# Altium project amoled-watch.PrjPcb
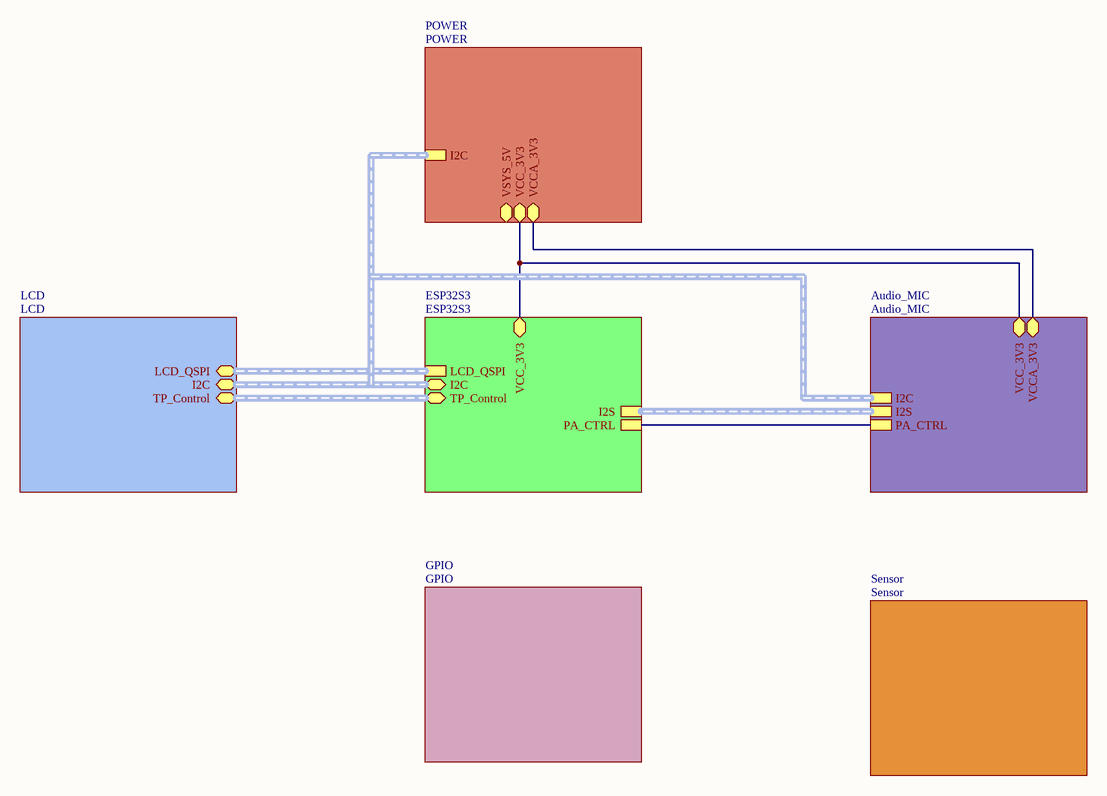
[diagram p0: Overview.SchDoc]
7 sheets, 107 parts. Net scope: hierarchical (ports join the sheet entries above them; power ports are global).
Board file: PCB1.PcbDoc
Sheets:
  Overview.SchDoc
    ESP32S3 = ESP32S3.SchDoc
    LCD = LCD.SchDoc
    Audio_MIC = Audio_MIC.SchDoc
    GPIO = GPIO.SchDoc
    Sensor = Sensor.SchDoc
  PMIC.SchDoc

## Sheet Overview.SchDoc
size A4; SheetNumber: 1; SheetTotal: 7

### Sub-sheets
Audio_MIC = Audio_MIC: VCCA_3V3 (bidir), VCC_3V3 (bidir), I2C, I2S, PA_CTRL
ESP32S3 = ESP32S3: LCD_QSPI, I2C (bidir), TP_Control (bidir), VCC_3V3 (bidir), I2S, PA_CTRL
GPIO = GPIO: no entries
LCD = LCD: LCD_QSPI (bidir), I2C (bidir), TP_Control (bidir)
POWER = POWER (file not in this document): I2C, VSYS_5V (bidir), VCC_3V3 (bidir), VCCA_3V3 (bidir)
Sensor = Sensor: no entries

### Nets
VCC_3V3: sheet ESP32S3/VCC_3V3, sheet POWER/VCC_3V3, sheet Audio_MIC/VCC_3V3
PA_CTRL: sheet ESP32S3/PA_CTRL, sheet Audio_MIC/PA_CTRL
VCCA_3V3: sheet POWER/VCCA_3V3, sheet Audio_MIC/VCCA_3V3

### Buses and harness runs
harness sheet Audio_MIC/I2C = sheet ESP32S3/I2C = sheet LCD/I2C = sheet POWER/I2C
harness sheet Audio_MIC/I2S = sheet ESP32S3/I2S
harness sheet ESP32S3/LCD_QSPI = sheet LCD/LCD_QSPI
harness sheet ESP32S3/TP_Control = sheet LCD/TP_Control

## Sheet ESP32S3.SchDoc
size A3; SheetNumber: 2; SheetTotal: 7
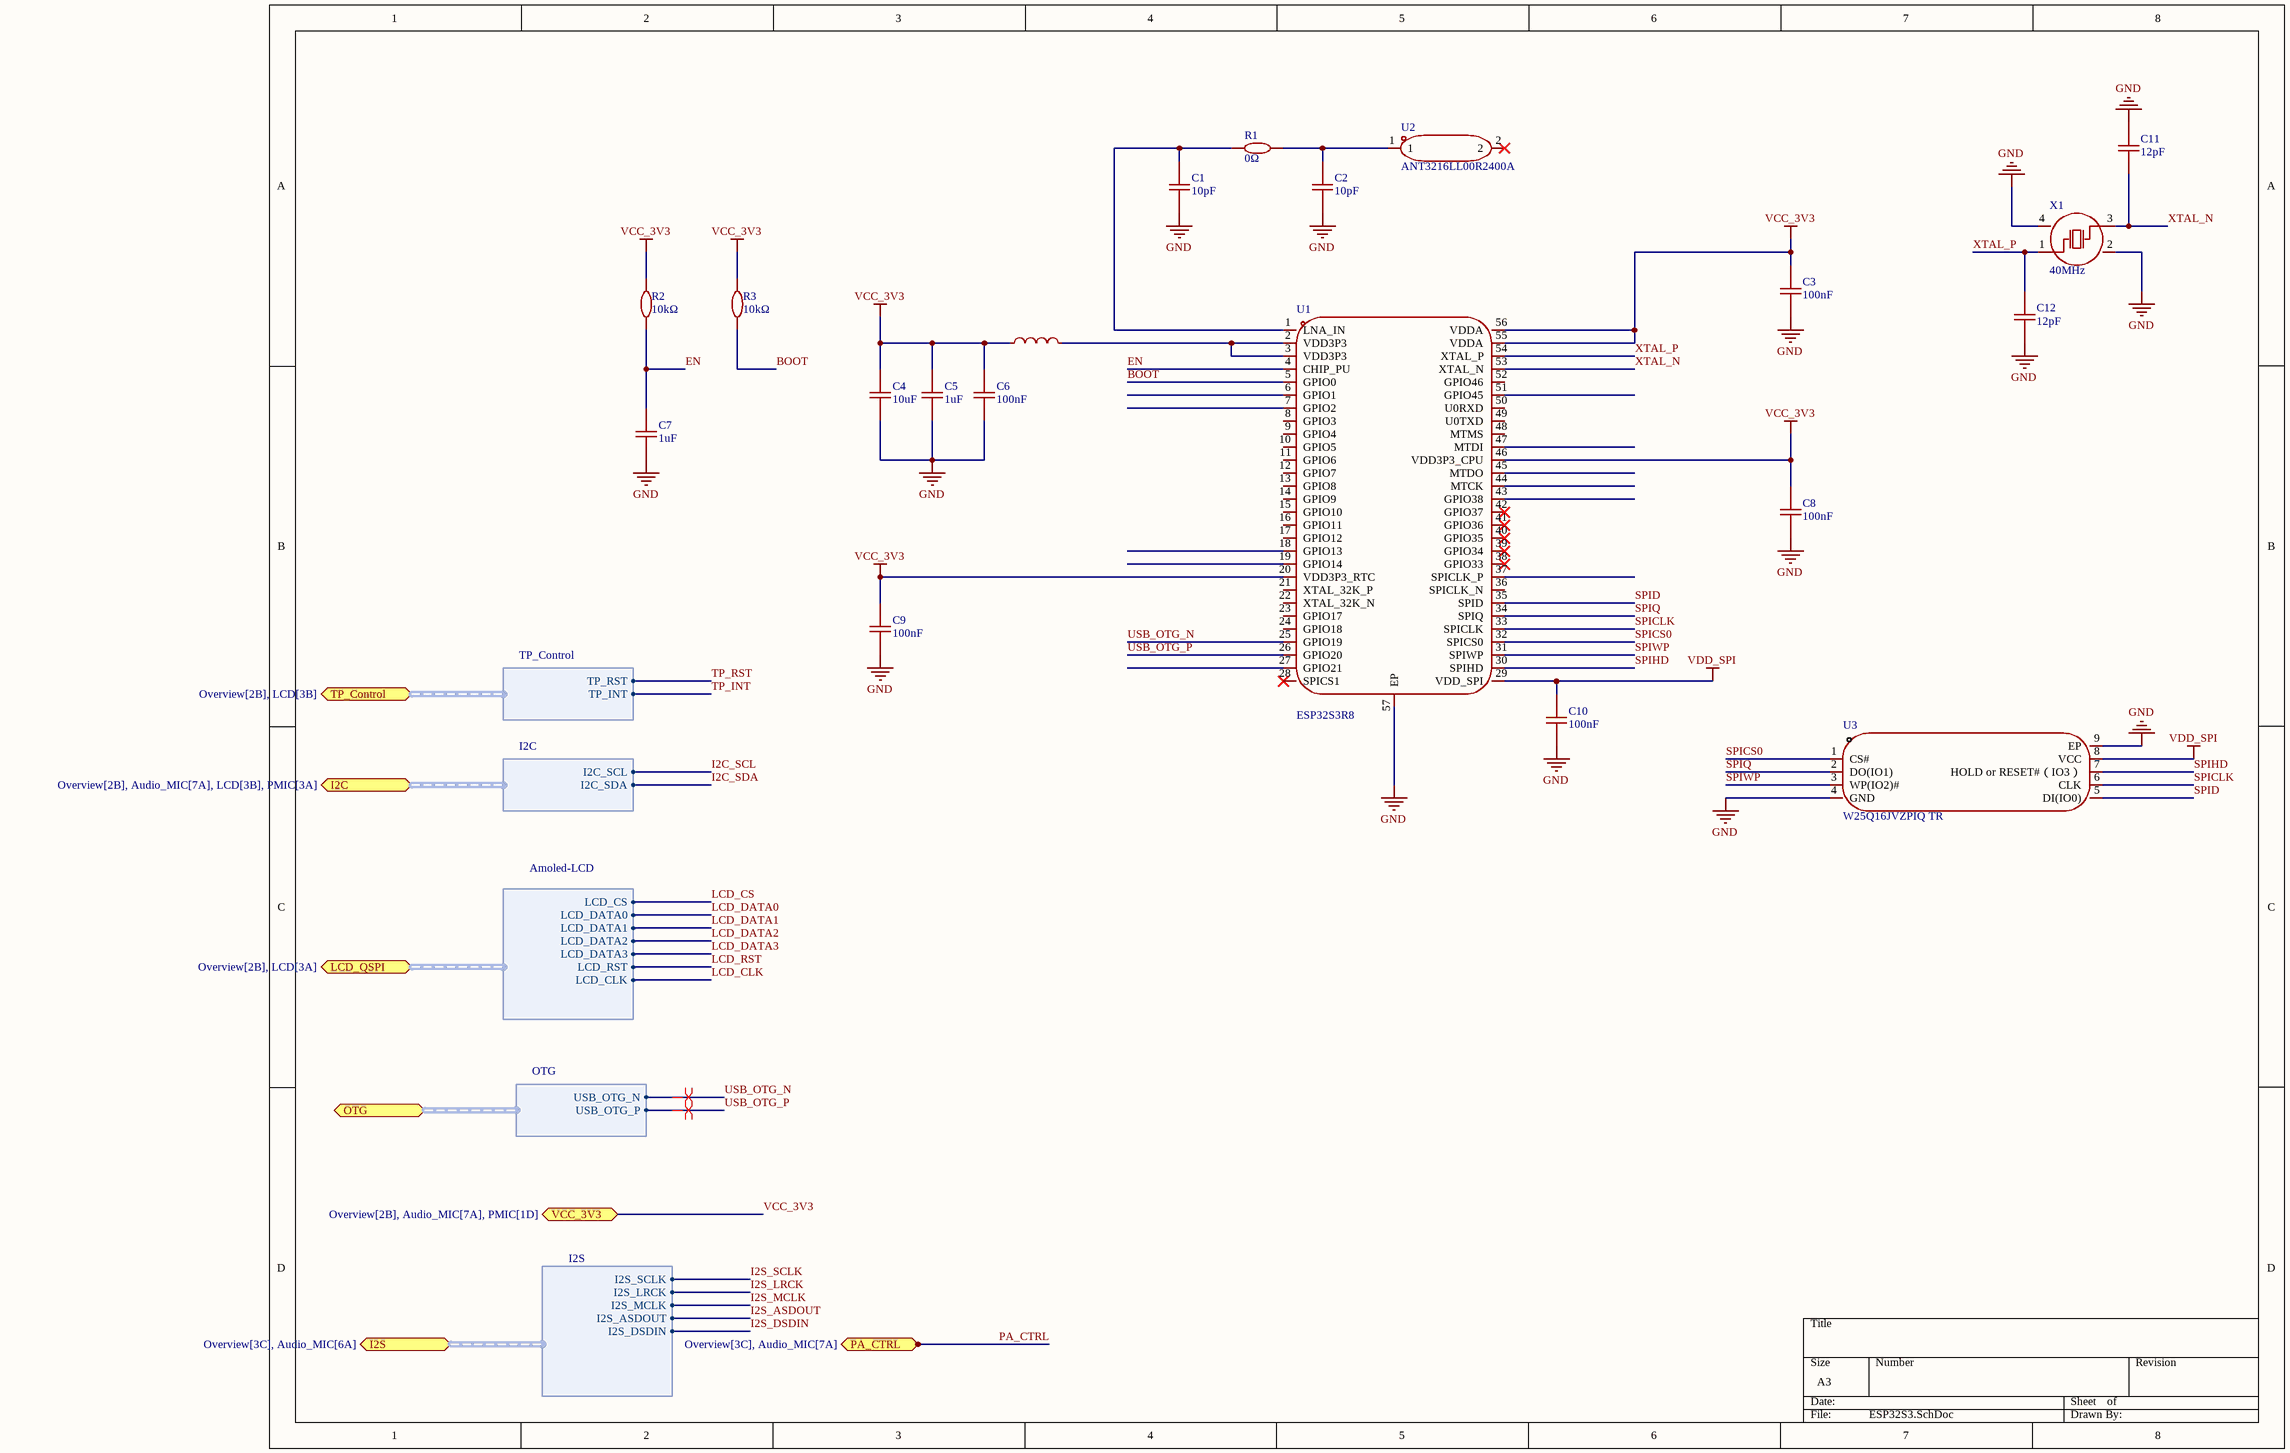
[diagram p1: ESP32S3.SchDoc]

### Parts
C1  10pF  [C0402]
C2  10pF  [C0402]
C3  100nF  [C0402]
C4  10uF  [C0603]
C5  1uF  [C0402]
C6  100nF  [C0402]
C7  1uF  [C0402]
C8  100nF  [C0402]
C9  100nF  [C0402]
C10  100nF  [C0402]
C11  12pF  [C0402]
C12  12pF  [C0402]
L1  2nH  [L0402]  (value not drawn)
R1  0Ω  [R0402]
R2  10kΩ  [R0402]
R3  10kΩ  [R0402]
U1  ESP32S3R8  [QFN-56_L7.0-W7.0-P0.40-TL-EP4.0]
U2  ANT3216LL00R2400A  [ANT-SMD_L3.2-W1.6]
U3  W25Q16JVZPIQ TR  [WSON-8_L6.0-W5.0-P1.27-BL-EP]
X1  40MHz  [OSC-SMD_4P-L3.2-W2.5-BL_SIT8008BI]

### Ports
I2C (bidir, harness I2C, see Overview[2B], Audio_MIC[7A], LCD[3B], PMIC[3A]), I2S (bidir, harness I2S, see Overview[3C], Audio_MIC[6A]), LCD_QSPI (bidir, harness Amoled-LCD, see Overview[2B], LCD[3A]), OTG (bidir, harness OTG), PA_CTRL (bidir, see Overview[3C], Audio_MIC[7A]), TP_Control (bidir, harness TP_Control, see Overview[2B], LCD[3B]), VCC_3V3 (bidir, see Overview[2B], Audio_MIC[7A], PMIC[1D])

### Harnesses
Amoled-LCD: LCD_CS, LCD_DATA0, LCD_DATA1, LCD_DATA2, LCD_DATA3, LCD_RST, LCD_CLK
I2C: I2C_SCL, I2C_SDA
TP_Control: TP_RST, TP_INT
OTG: USB_OTG_N, USB_OTG_P
I2S: I2S_SCLK, I2S_LRCK, I2S_MCLK, I2S_ASDOUT, I2S_DSDIN

### Nets
GND: C1.1 C2.1 C3.1 C4.1 C5.1 C6.1 C7.1 C8.1 C9.1 C10.1 C11.2 C12.1 U1.57(EP) U3.4(GND) U3.9(EP) X1.2(GND) X1.4(GND)
VCC_3V3: C3.2 C4.2 C5.2 C6.2 C8.2 C9.2 L1.1 R2.2 R3.2 U1.20(VDD3P3_RTC) U1.46(VDD3P3_CPU) U1.55(VDDA) U1.56(VDDA) ; port VCC_3V3
VDD_SPI: C10.2 U1.29(VDD_SPI) U3.8(VCC)
BOOT: R3.1 U1.5(GPIO0)
EN: C7.2 R2.1 U1.4(CHIP_PU)
SPICLK: U1.33(SPICLK) U3.6(CLK)
SPICS0: U1.32(SPICS0) U3.1(CS#)
SPID: U1.35(SPID) U3.5(DI(IO0))
SPIHD: U1.30(SPIHD) U3.7(HOLD_or_RESET#（IO3）)
SPIQ: U1.34(SPIQ) U3.2(DO(IO1))
SPIWP: U1.31(SPIWP) U3.3(WP(IO2)#)
USB_OTG_N: U1.25(GPIO19) ; port OTG.USB_OTG_N
USB_OTG_P: U1.26(GPIO20) ; port OTG.USB_OTG_P
XTAL_N: C11.1 U1.53(XTAL_N) X1.3(OSC2)
XTAL_P: C12.2 U1.54(XTAL_P) X1.1(OSC1)
NetC1_2: C1.2 R1.1 U1.1(LNA_IN)
NetC2_2: C2.2 R1.2 U2.1
NetL1_2: L1.2 U1.2(VDD3P3) U1.3(VDD3P3)

Not connected (* = marked no-connect by the designer): U1 6(GPIO1) 7(GPIO2) 8(GPIO3) 9(GPIO4) 10(GPIO5) 11(GPIO6) 12(GPIO7) 13(GPIO8) 14(GPIO9) 15(GPIO10) 16(GPIO11) 17(GPIO12) 18(GPIO13) 19(GPIO14) 21(XTAL_32K_P) 22(XTAL_32K_N) 23(GPIO17) 24(GPIO18) 27(GPIO21) 28(SPICS1)* 36(SPICLK_N) 37(SPICLK_P) 38(GPIO33)* 39(GPIO34)* 40(GPIO35)* 41(GPIO36)* 42(GPIO37)* 43(GPIO38) 44(MTCK) 45(MTDO) 47(MTDI) 48(MTMS) 49(U0TXD) 50(U0RXD) 51(GPIO45) 52(GPIO46); U2 2*

### Layout directives
differential pair: USB_OTG_N, USB_OTG_P

### Library data of the parts
C1 C2 = 10pF: 50V 10pF C0G ±5% 0402 Ceramic Capacitors ROHS
C3 C6 C8-C10 = 100nF: 50V 100nF X7R ±10% 0402 Ceramic Capacitors ROHS
C4 = 10uF: 10V 10uF X5R ±10% 0603 Ceramic Capacitors ROHS
C5 C7 = 1uF: 50V 1uF X5R ±10% 0402 Ceramic Capacitors ROHS
C11 C12 = 12pF: 50V 12pF C0G ±5% 0402 Ceramic Capacitors ROHS
L1 = MLG1005S2N0BT000: L0402 2nH ±0.1nH; Manufacturer: Sunltech(顺磁); Symbol: SLW4030S1R0NST; Add into BOM: yes; Value: 1uH; Tolerance: ±30%; Current Rating: 4.15A; DC Resistance(DCR): 18mΩ; Device: SLW4030S1R0NST; LCSC Part Name: 1uH ±30%; Supplier Part: C206354; Manufacturer Part: SLW4030S1R0NST; Supplier Footprint: SMD,4x4mm; JLCPCB Part Class: Extended Part; Datasheet: https://item.szlcsc.com/datasheet/SLW4030S1R0NST/207399.html; Supplier: LCSC; Convert to PCB: yes
R1 = 0Ω: 0Ω 62.5mW 50V Thick Film Resistor ±1% 0402 Chip Resistor - Surface Mount ROHS
R2 R3 = 10kΩ: 62.5mW 10kΩ 50V ±100ppm/℃ Thick Film Resistor ±1% 0402 Chip Resistor - Surface Mount ROHS
U1 = ESP32S3R8: 2.4GHz Wi-Fi + 低功耗蓝牙系统级芯片（SoC）
U3 = W25Q16JVZPIQ TR: WSON-8-EP(5x6) W25Q128JV（128M位）串行闪存为空间、引脚和电源受限的系统提供了存储解决方案。25Q系列具备灵活性和高性能。
X1 = X322540MPB4SI: Crystal Oscillator 15pF SMD3225-4P Crystals ROHS

## Sheet LCD.SchDoc
size A4; SheetNumber: 4; SheetTotal: 7
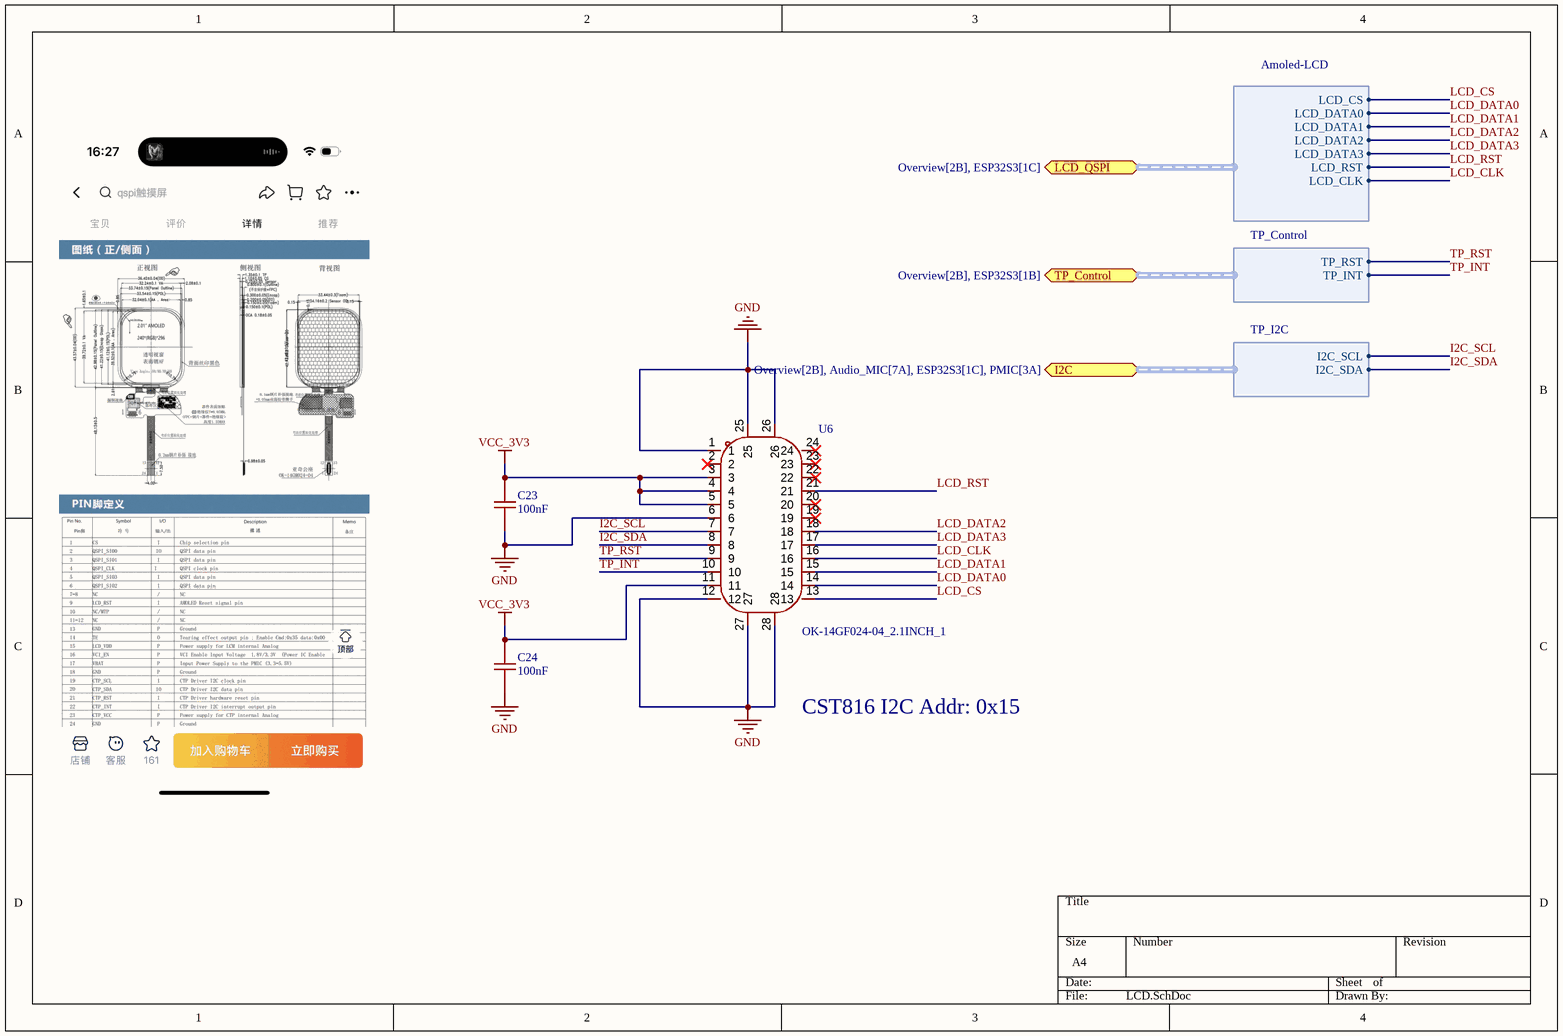
[diagram p2: LCD.SchDoc]

### Parts
C23  100nF  [C0402]
C24  100nF  [C0402]
U6  OK-14GF024-04_2.1INCH_1  [CONN-SMD_24P-P0.40_OK-14GF024-04_2.1INCH]

### Ports
I2C (bidir, harness TP_I2C, see Overview[2B], Audio_MIC[7A], ESP32S3[1C], PMIC[3A]), LCD_QSPI (bidir, harness Amoled-LCD, see Overview[2B], ESP32S3[1C]), TP_Control (bidir, harness TP_Control, see Overview[2B], ESP32S3[1B])

### Harnesses
Amoled-LCD: LCD_CS, LCD_DATA0, LCD_DATA1, LCD_DATA2, LCD_DATA3, LCD_RST, LCD_CLK
TP_I2C: I2C_SCL, I2C_SDA
TP_Control: TP_RST, TP_INT

### Nets
GND: C23.1 C24.1 U6.1 U6.6 U6.12 U6.25 U6.26 U6.27 U6.28
VCC_3V3: C23.2 C24.2 U6.3 U6.4 U6.5 U6.11
I2C_SCL: U6.7 ; port I2C.I2C_SCL
I2C_SDA: U6.8 ; port I2C.I2C_SDA
LCD_CLK: U6.16 ; port LCD_QSPI.LCD_CLK
LCD_CS: U6.13 ; port LCD_QSPI.LCD_CS
LCD_DATA0: U6.14 ; port LCD_QSPI.LCD_DATA0
LCD_DATA1: U6.15 ; port LCD_QSPI.LCD_DATA1
LCD_DATA2: U6.18 ; port LCD_QSPI.LCD_DATA2
LCD_DATA3: U6.17 ; port LCD_QSPI.LCD_DATA3
LCD_RST: U6.21 ; port LCD_QSPI.LCD_RST
TP_INT: U6.10 ; port TP_Control.TP_INT
TP_RST: U6.9 ; port TP_Control.TP_RST

Not connected (* = marked no-connect by the designer): U6 2* 19* 20* 22* 23* 24*

### Notes on the sheet
- CST816 I2C Addr: 0x15

### Library data of the parts
C23 C24 = 100nF: as C3 on sheet ESP32S3
U6 = OK-14GF024-04_2.1INCH_1: OK- 14 0.4mm 24Pin

## Sheet Audio_MIC.SchDoc
size A3; SheetNumber: 5; SheetTotal: 7
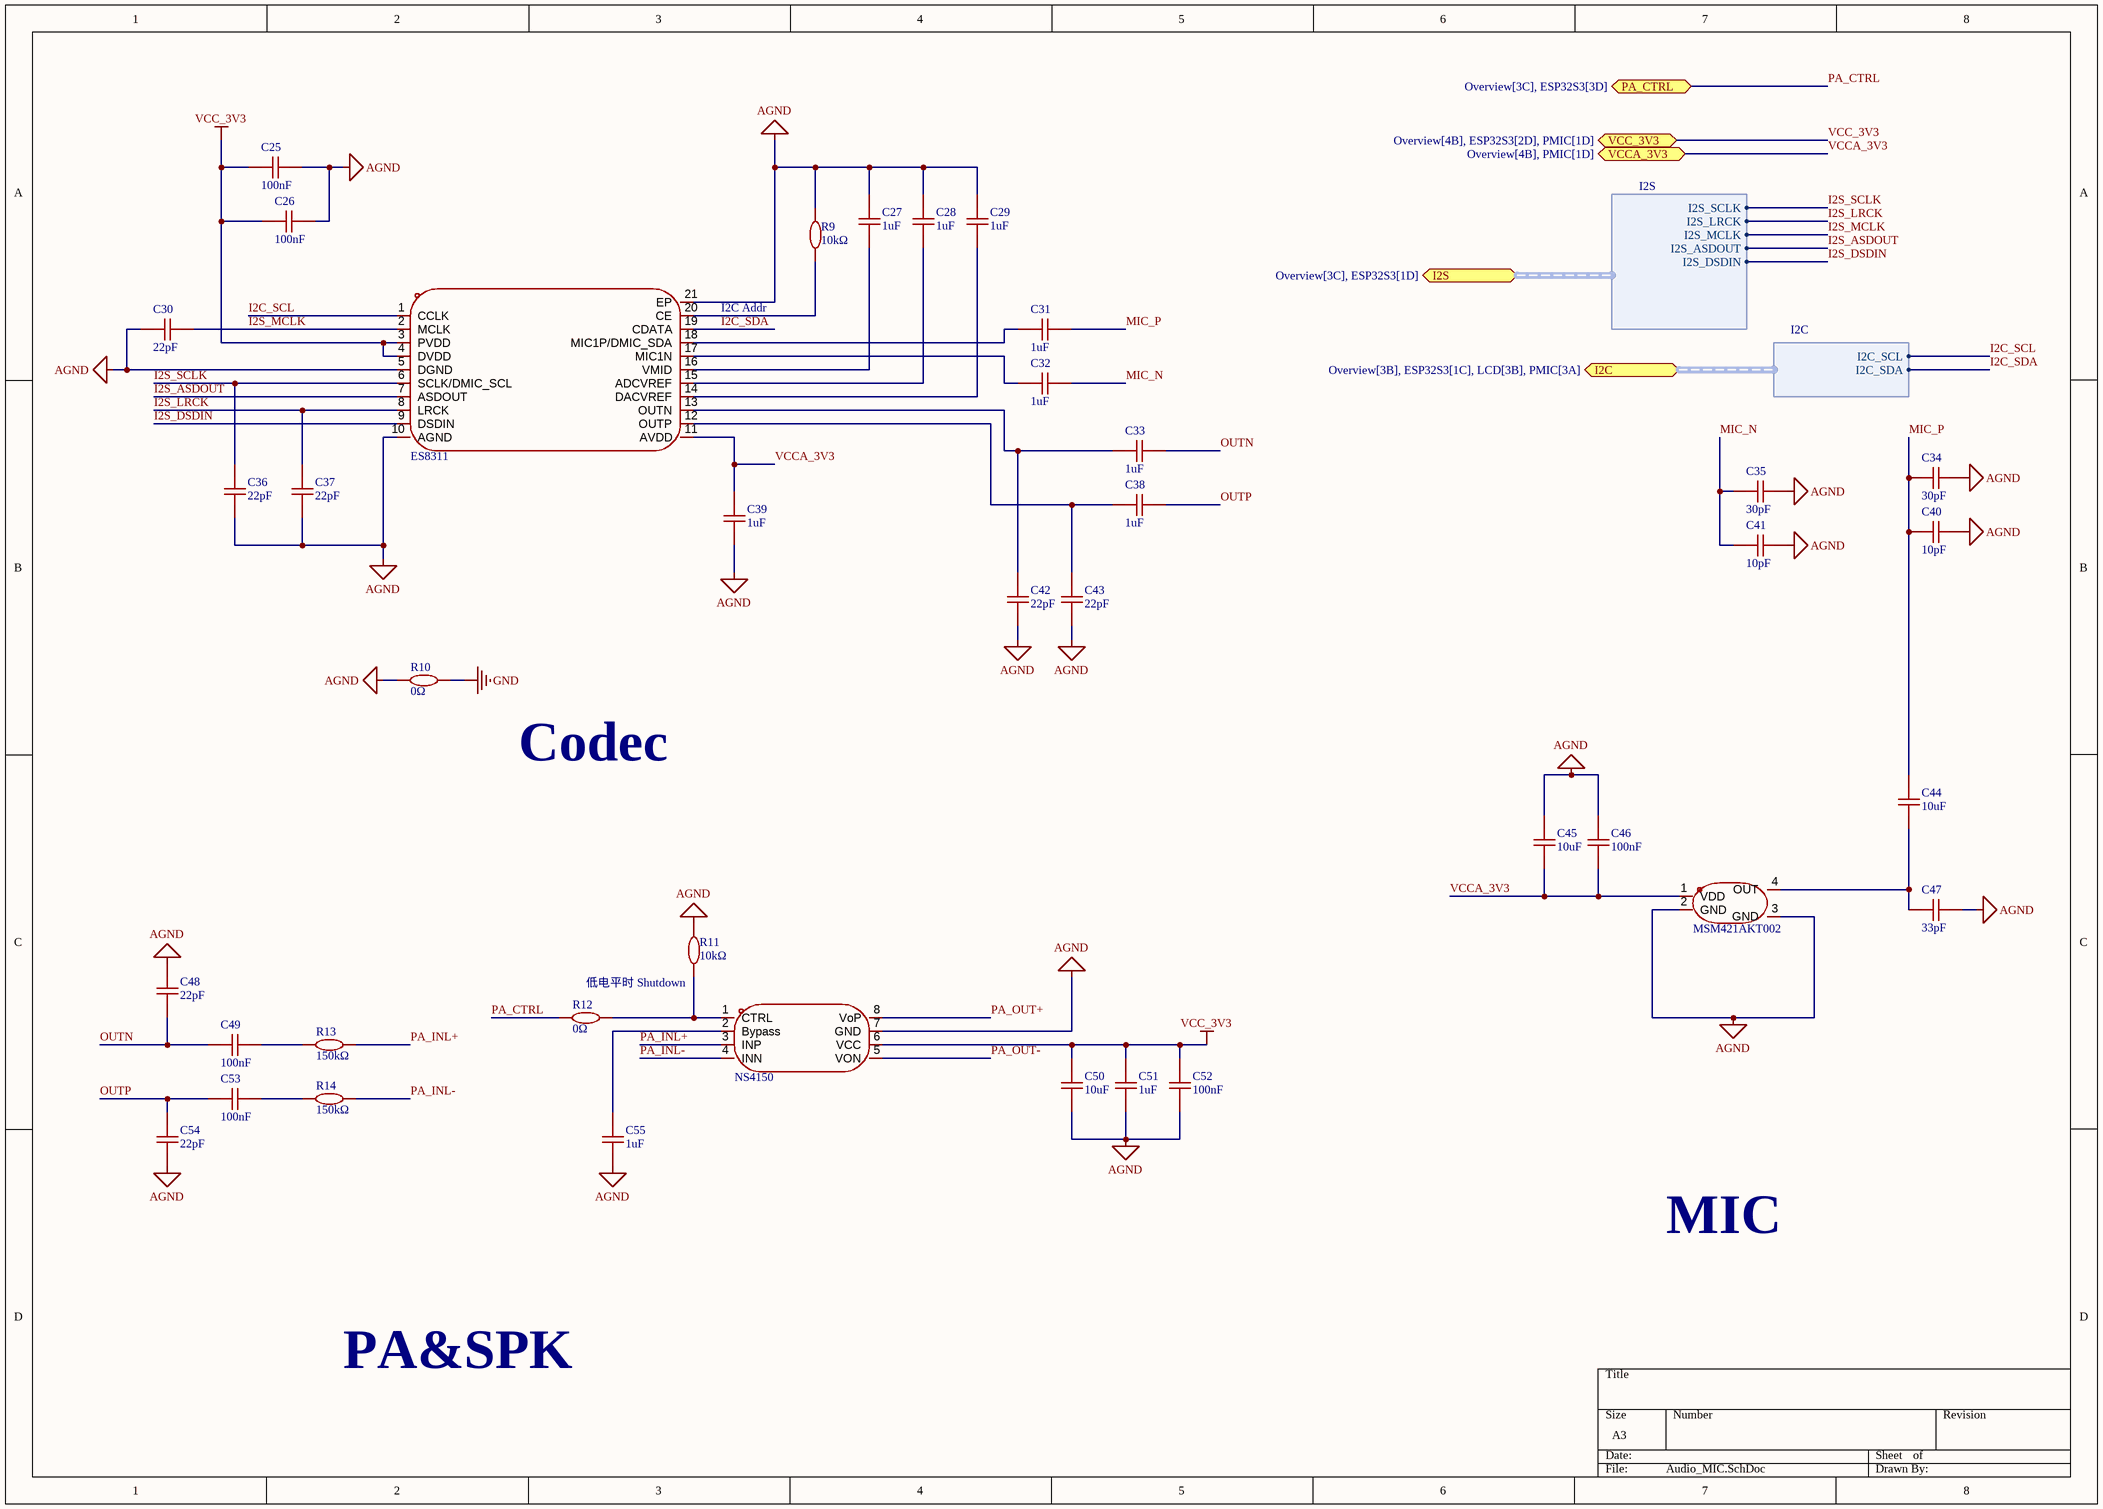
[diagram p3: Audio_MIC.SchDoc]

### Parts
C25  100nF  [C0402]
C26  100nF  [C0402]
C27  1uF  [C0402]
C28  1uF  [C0402]
C29  1uF  [C0402]
C30  22pF  [C0402]
C31  1uF  [C0402]
C32  1uF  [C0402]
C33  1uF  [C0402]
C34  30pF  [C0402]
C35  30pF  [C0402]
C36  22pF  [C0402]
C37  22pF  [C0402]
C38  1uF  [C0402]
C39  1uF  [C0402]
C40  10pF  [C0402]
C41  10pF  [C0402]
C42  22pF  [C0402]
C43  22pF  [C0402]
C44  10uF  [C0603]
C45  10uF  [C0603]
C46  100nF  [C0402]
C47  33pF  [C0402]
C48  22pF  [C0402]
C49  100nF  [C0402]
C50  10uF  [C0603]
C51  1uF  [C0402]
C52  100nF  [C0402]
C53  100nF  [C0402]
C54  22pF  [C0402]
C55  1uF  [C0402]
R9  10kΩ  [R0402]
R10  0Ω  [R0402]
R11  10kΩ  [R0402]
R12  0Ω  [R0402]
R13  150kΩ  [R0402]
R14  150kΩ  [R0402]
U7  ES8311  [WQFN-20_L3.0-W3.0-P0.40-BL-EP1.7]
U8  MSM421AKT002  [LGA-4_L3.8-W3.0-P2.46-TR]
U9  NS4150  [MSOP-8_L3.0-W3.0-P0.65-LS5.0-BL]

### Ports
I2C (bidir, harness I2C, see Overview[3B], ESP32S3[1C], LCD[3B], PMIC[3A]), I2S (bidir, harness I2S, see Overview[3C], ESP32S3[1D]), PA_CTRL (bidir, see Overview[3C], ESP32S3[3D]), VCC_3V3 (bidir, see Overview[4B], ESP32S3[2D], PMIC[1D]), VCCA_3V3 (bidir, see Overview[4B], PMIC[1D])

### Harnesses
I2S: I2S_SCLK, I2S_LRCK, I2S_MCLK, I2S_ASDOUT, I2S_DSDIN
I2C: I2C_SCL, I2C_SDA

### Nets
AGND: C25.1 C26.1 C27.2 C28.2 C29.2 C30.2 C34.2 C35.2 C36.2 C37.2 C39.1 C40.2 C41.2 C42.1 C43.1 C45.2 C46.1 C47.2 C48.1 C50.1 C51.1 C52.2 C54.2 C55.1 R9.2 R10.1 R11.2 U7.5(DGND) U7.10(AGND) U7.21(EP) U8.2(GND) U8.3(GND) U9.7(GND)
GND: R10.2
VCC_3V3: C25.2 C26.2 C50.2 C51.2 C52.1 U7.3(PVDD) U7.4(DVDD) U9.6(VCC) ; port VCC_3V3
I2C_SCL: U7.1(CCLK) ; port I2C.I2C_SCL
I2C_SDA: U7.19(CDATA) ; port I2C.I2C_SDA
I2S_ASDOUT: U7.7(ASDOUT) ; port I2S.I2S_ASDOUT
I2S_DSDIN: U7.9(DSDIN) ; port I2S.I2S_DSDIN
I2S_LRCK: C37.1 U7.8(LRCK) ; port I2S.I2S_LRCK
I2S_MCLK: C30.1 U7.2(MCLK) ; port I2S.I2S_MCLK
I2S_SCLK: C36.1 U7.6(SCLK/DMIC_SCL) ; port I2S.I2S_SCLK
MIC_N: C32.2 C35.1 C41.1
MIC_P: C31.2 C34.1 C40.1 C44.2
OUTN: C33.2 C48.2 C49.2
OUTP: C38.2 C53.2 C54.1
PA_CTRL: R12.1 ; port PA_CTRL
PA_INL+: R13.2 U9.3(INP)
PA_INL-: R14.2 U9.4(INN)
PA_OUT+: U9.8(VoP)
PA_OUT-: U9.5(VON)
VCCA_3V3: C39.2 C45.1 C46.2 U7.11(AVDD) U8.1(VDD) ; port VCCA_3V3
NetC27_1: C27.1 U7.16(VMID)
NetC28_1: C28.1 U7.15(ADCVREF)
NetC29_1: C29.1 U7.14(DACVREF)
NetC31_1: C31.1 U7.18(MIC1P/DMIC_SDA)
NetC32_1: C32.1 U7.17(MIC1N)
NetC33_1: C33.1 C42.2 U7.13(OUTN)
NetC38_1: C38.1 C43.2 U7.12(OUTP)
NetC44_1: C44.1 C47.1 U8.4(OUT)
NetC49_1: C49.1 R13.1
NetC53_1: C53.1 R14.1
NetC55_2: C55.2 U9.2(Bypass)
NetR9_1: R9.1 U7.20(CE)
NetR11_1: R11.1 R12.2 U9.1(CTRL)

### Notes on the sheet
- (near U7) I2C Addr
- Codec
- 低电平时 Shutdown
- MIC
- PA&SPK

### Library data of the parts
C25 C26 C46 C49 C52 C53 = 100nF: as C3 on sheet ESP32S3
C27-C29 C31-C33 C38 C39 C51 C55 = 1uF: as C5 on sheet ESP32S3
C30 C34-C37 C40-C43 C47 C48 C54 = 22pF: 50V 22pF C0G ±5% 0402 Ceramic Capacitors ROHS
C44 C45 C50 = 10uF: as C4 on sheet ESP32S3
R9 R11 = 10kΩ: as R2 on sheet ESP32S3
R10 R12 = 0Ω: as R1 on sheet ESP32S3
R13 R14 = 150kΩ: 62.5mW 150kΩ 50V ±100ppm/℃ Thick Film Resistor ±1% 0402 Chip Resistor - Surface Mount ROHS
U7 = ES8311: 低功耗单声道音频编解码器; Symbol: ES8311
U8 = MSM421AKT002: 全指向型  信噪比 59dB 阻抗; Symbol: MSM421AKT002
U9 = NS4150: 超低EMI、无需滤波器、3W单声道D类音频功放; Symbol: NS4150

## Sheet GPIO.SchDoc
size A4; SheetNumber: 6; SheetTotal: 7
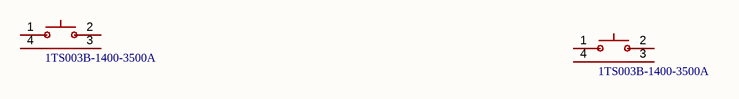
[diagram p4: GPIO.SchDoc]

### Parts
SW?  1TS003B-1400-3500A  [KEY-SMD_1TS003B]
SW??  1TS003B-1400-3500A  [KEY-SMD_1TS003B]

### Nets

Not connected (* = marked no-connect by the designer): SW? 1 2 3 4; SW?? 1 2 3 4

### Library data of the parts
SW? SW?? = 1TS003B-1400-3500A: 4.6*1.82*3.5mm 卧贴 轻触开关; Symbol: 1TS003B-1400-3500A

## Sheet Sensor.SchDoc
size A3; SheetNumber: 7; SheetTotal: 7
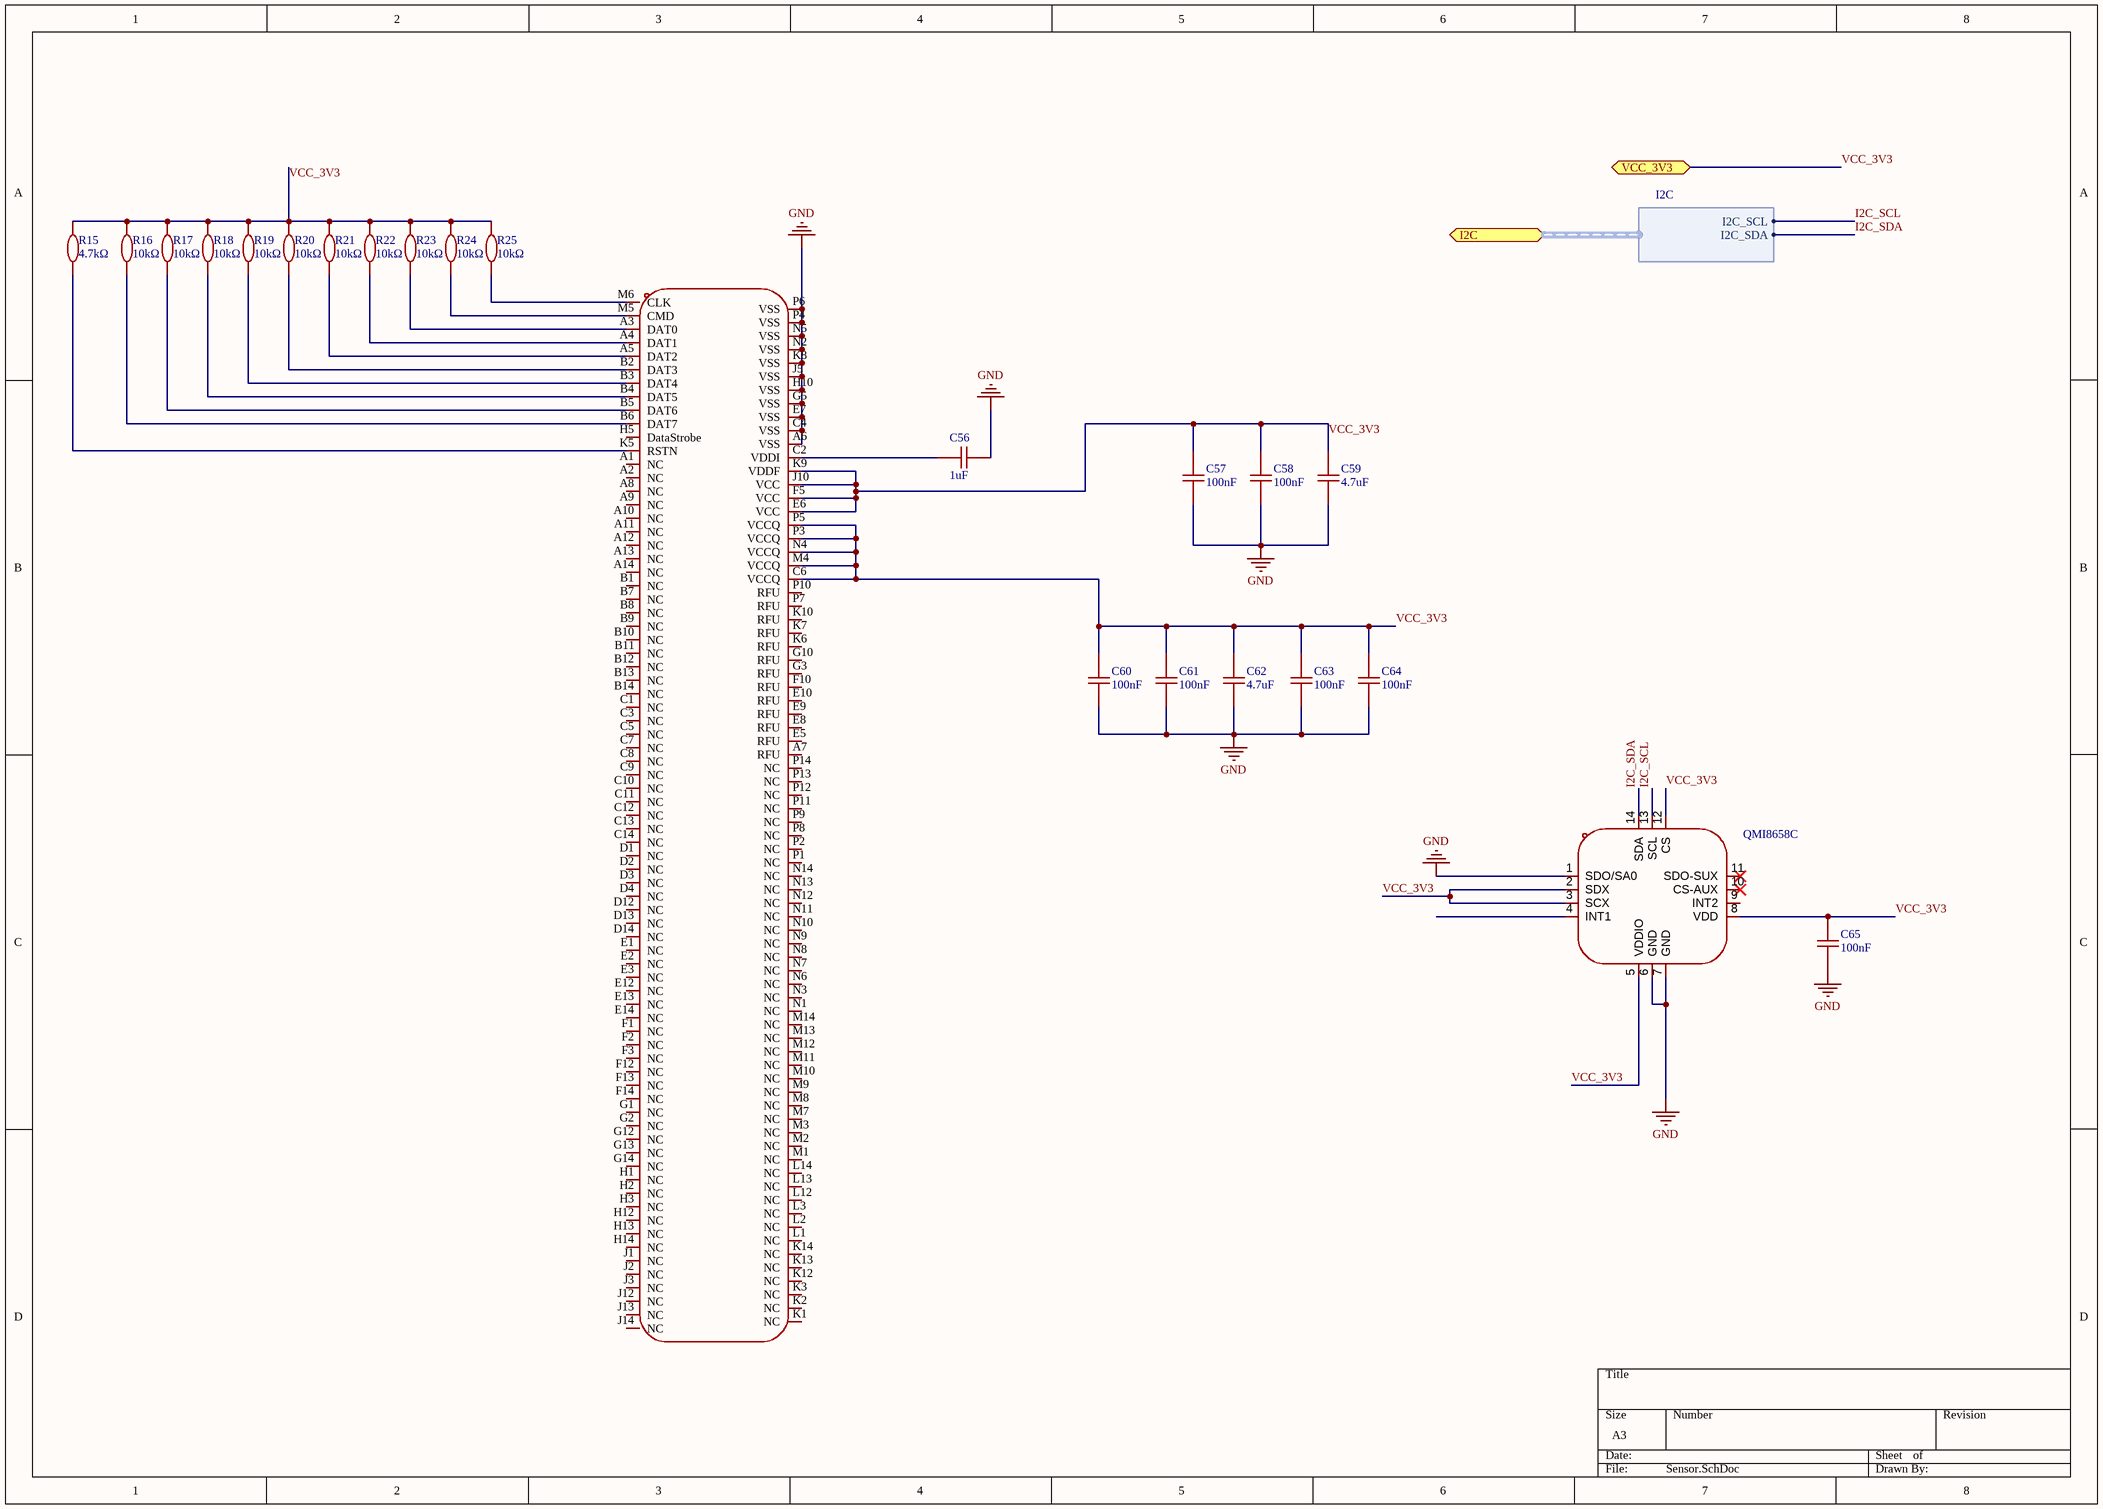
[diagram p5: Sensor.SchDoc]

### Parts
C56  1uF  [C0402]
C57  100nF  [C0402]
C58  100nF  [C0402]
C59  4.7uF  [C0402]
C60  100nF  [C0402]
C61  100nF  [C0402]
C62  4.7uF  [C0402]
C63  100nF  [C0402]
C64  100nF  [C0402]
C65  100nF  [C0402]
R15  4.7kΩ  [R0402]
R16  10kΩ  [R0402]
R17  10kΩ  [R0402]
R18  10kΩ  [R0402]
R19  10kΩ  [R0402]
R20  10kΩ  [R0402]
R21  10kΩ  [R0402]
R22  10kΩ  [R0402]
R23  10kΩ  [R0402]
R24  10kΩ  [R0402]
R25  10kΩ  [R0402]
U10  QMI8658C  [LGA-14_L3.0-W2.5-P0.50-BR]
U11  KLM8G1GETF-B041  [FBGA-153_L13.0-W11.5-P0.50_KLMAG1JETD-B041]  (value not drawn)

### Ports
I2C (bidir, harness I2C), VCC_3V3 (bidir)

### Harnesses
I2C: I2C_SCL, I2C_SDA

### Nets
GND: C56.2 C57.1 C58.1 C59.1 C60.1 C61.1 C62.1 C63.1 C64.1 C65.1 U10.1(SDO/SA0) U10.6(GND) U10.7(GND) U11.A6(VSS) U11.C4(VSS) U11.E7(VSS) U11.G5(VSS) U11.H10(VSS) U11.J5(VSS) U11.K8(VSS) U11.N2(VSS) U11.N5(VSS) U11.P4(VSS) U11.P6(VSS)
I2C_SCL: U10.13(SCL) ; port I2C.I2C_SCL
I2C_SDA: U10.14(SDA) ; port I2C.I2C_SDA
VCC_3V3: C57.2 C58.2 C59.2 C60.2 C61.2 C62.2 C63.2 C64.2 C65.2 R15.2 R16.2 R17.2 R18.2 R19.2 R20.2 R21.2 R22.2 R23.2 R24.2 R25.2 U10.2(SDX) U10.3(SCX) U10.5(VDDIO) U10.8(VDD) U10.12(CS) U11.C6(VCCQ) U11.E6(VCC) U11.F5(VCC) U11.J10(VCC) U11.K9(VDDF) U11.M4(VCCQ) U11.N4(VCCQ) U11.P3(VCCQ) U11.P5(VCCQ) ; port VCC_3V3
NetC56_1: C56.1 U11.C2(VDDI)
NetR15_1: R15.1 U11.K5(RSTN)
NetR16_1: R16.1 U11.B6(DAT7)
NetR17_1: R17.1 U11.B5(DAT6)
NetR18_1: R18.1 U11.B4(DAT5)
NetR19_1: R19.1 U11.B3(DAT4)
NetR20_1: R20.1 U11.B2(DAT3)
NetR21_1: R21.1 U11.A5(DAT2)
NetR22_1: R22.1 U11.A4(DAT1)
NetR23_1: R23.1 U11.A3(DAT0)
NetR24_1: R24.1 U11.M5(CMD)
NetR25_1: R25.1 U11.M6(CLK)

Not connected (* = marked no-connect by the designer): U10 4(INT1) 9(INT2) 10(CS-AUX)* 11(SDO-SUX)*; U11 A1(NC) A2(NC) A7(RFU) A8(NC) A9(NC) A10(NC) A11(NC) A12(NC) A13(NC) A14(NC) B1(NC) B7(NC) B8(NC) B9(NC) B10(NC) B11(NC) B12(NC) B13(NC) B14(NC) C1(NC) C3(NC) C5(NC) C7(NC) C8(NC) C9(NC) C10(NC) C11(NC) C12(NC) C13(NC) C14(NC) D1(NC) D2(NC) D3(NC) D4(NC) D12(NC) D13(NC) D14(NC) E1(NC) E2(NC) E3(NC) E5(RFU) E8(RFU) E9(RFU) E10(RFU) E12(NC) E13(NC) E14(NC) F1(NC) F2(NC) F3(NC) F10(RFU) F12(NC) F13(NC) F14(NC) G1(NC) G2(NC) G3(RFU) G10(RFU) G12(NC) G13(NC) G14(NC) H1(NC) H2(NC) H3(NC) H5(DataStrobe) H12(NC) H13(NC) H14(NC) J1(NC) J2(NC) J3(NC) J12(NC) J13(NC) J14(NC) K1(NC) K2(NC) K3(NC) K6(RFU) K7(RFU) K10(RFU) K12(NC) K13(NC) K14(NC) L1(NC) L2(NC) L3(NC) L12(NC) L13(NC) L14(NC) M1(NC) M2(NC) M3(NC) M7(NC) M8(NC) M9(NC) M10(NC) M11(NC) M12(NC) M13(NC) M14(NC) N1(NC) N3(NC) N6(NC) N7(NC) N8(NC) N9(NC) N10(NC) N11(NC) N12(NC) N13(NC) N14(NC) P1(NC) P2(NC) P7(RFU) P8(NC) P9(NC) P10(RFU) P11(NC) P12(NC) P13(NC) P14(NC)

### Library data of the parts
C56 = 1uF: as C5 on sheet ESP32S3
C57 C58 C60 C61 C63-C65 = 100nF: as C3 on sheet ESP32S3
C59 C62 = 4.7uF: 10V 4.7uF X5R ±20% 0402 Ceramic Capacitors ROHS
R15-R25 = 10kΩ: as R2 on sheet ESP32S3
U10 = QMI8658C: 低噪声、宽带宽6D惯性测量单元，带运动协处理器和传感器融合功能; Symbol: QMI8658C
U11 = KLM8G1GETF-B041_1: 8GB 2.7V~3.6V eMMC 5.1 330/50 MB/s FBGA-153(11.5x13) Memory (ICs) ROHS; Manufacturer: SAMSUNG(三星半导体); Add into BOM: yes; Reading Speed in Sequence: 330MB/S; Writing Speed in Sequence: 50MB/S; Controller Operating Voltage (VCCQ): 2.7V~3.6V；1.7V~1.95V; Symbol: KLM8G1GETF-B041; Device: KLM8G1GETF-B041; LCSC Part Name: KLM8G1GETF-B041; Supplier Part: C499918; Manufacturer Part: KLM8G1GETF-B041; Supplier Footprint: FBGA-153(11.5x13); JLCPCB Part Class: Extended Part; Datasheet: https://item.szlcsc.com/datasheet/KLM8G1GETF-B041/512098.html; Supplier: LCSC; Convert to PCB: yes; configuration: -; Interface: eMMC 5.1; Voltage - Supply: 2.7V~3.6V; Operating Temperature: -25℃~+85℃; Sequential Read/Write (MB/s): 330/50 MB/s; Random Read/Write (IOPS): -; Memory Size: 8GB; NAND Operating Voltage (VCCF): 2.7V~3.6V

## Sheet PMIC.SchDoc
size A4; SheetNumber: 3; SheetTotal: 6
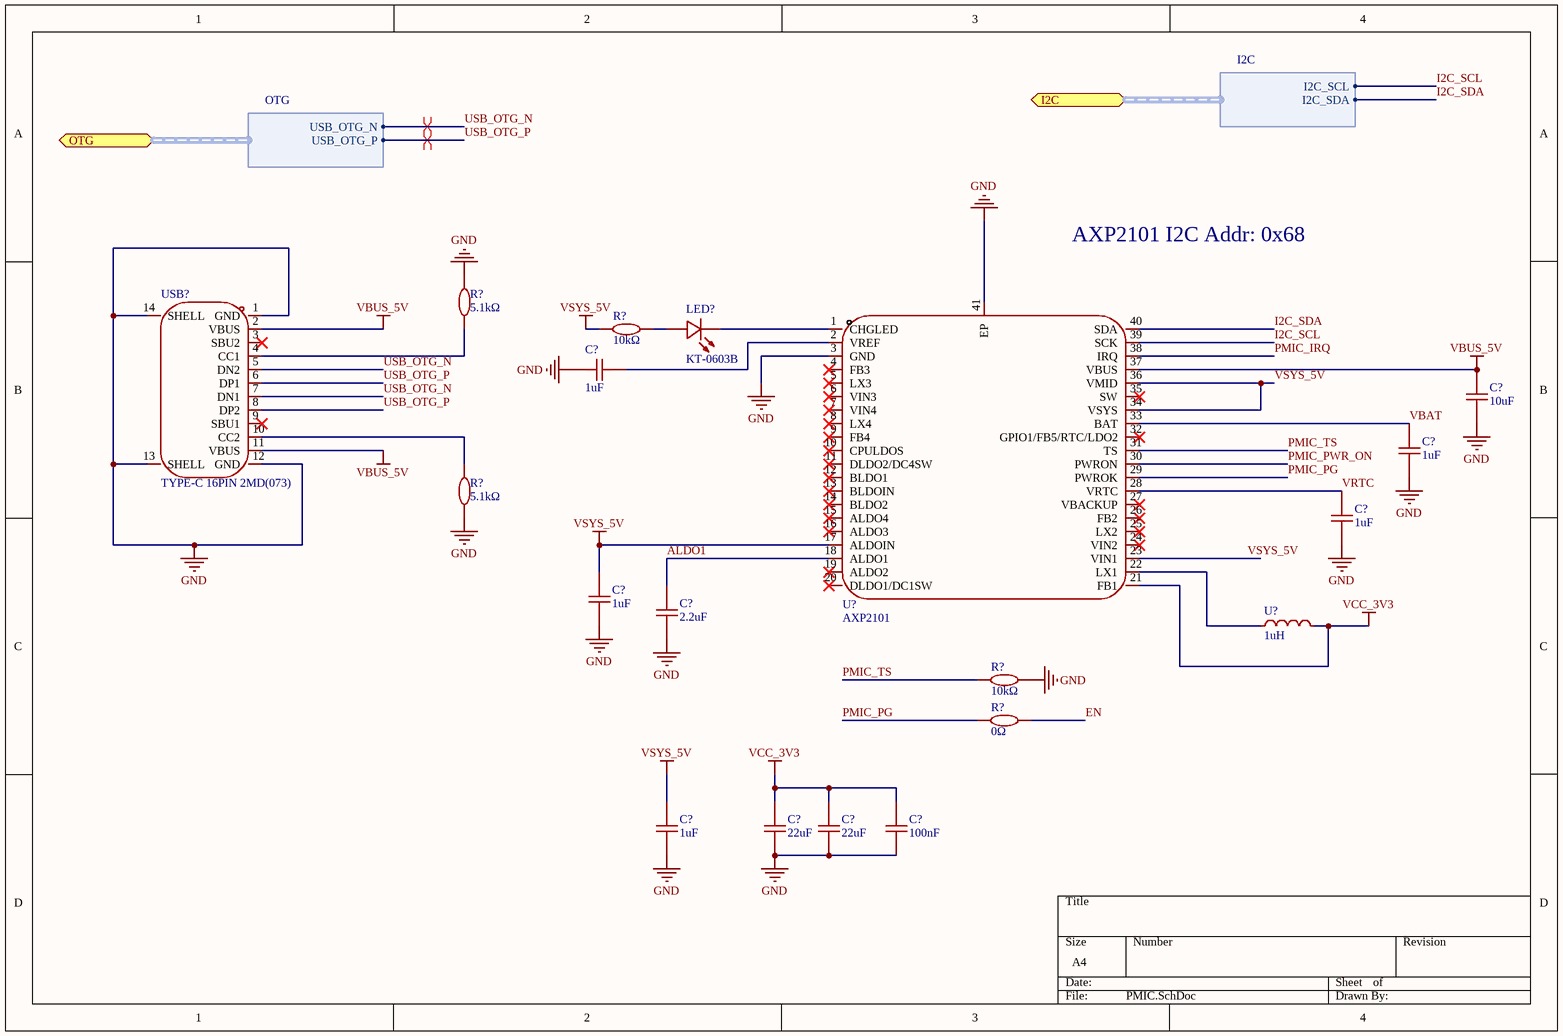
[diagram p6: PMIC.SchDoc]

### Parts
(Parts that share a designator on the sheet are numbered #1, #2 ... from top to bottom, then left to right.)
C?#1  1uF  [C0402]
C?#2  10uF  [C0603]
C?#3  1uF  [C0402]
C?#4  1uF  [C0402]
C?#5  1uF  [C0402]
C?#6  2.2uF  [C0402]
C?#7  1uF  [C0402]
C?#8  22uF  [C0603]
C?#9  22uF  [C0603]
C?#10  100nF  [C0402]
LED?  KT-0603B  [LED0603-BL]
R?#1  5.1kΩ  [R0402]
R?#2  10kΩ  [R0402]
R?#3  5.1kΩ  [R0402]
R?#4  10kΩ  [R0402]
R?#5  0Ω  [R0402]
U?#1  AXP2101  [QFN-40_L5.0-W5.0-P0.40-TL-EP3.4]
U?#2  1uH  [IND-SMD_L2.5-W2.0_WPN252012H]
USB?  TYPE-C 16PIN 2MD(073)  [USB-C-SMD_TYPE-C-6PIN-2MD-073]

### Ports
I2C (bidir, harness I2C), OTG (bidir, harness OTG)

### Harnesses
OTG: USB_OTG_N, USB_OTG_P
I2C: I2C_SCL, I2C_SDA

### Nets
GND: C?#1.1 C?#2.1 C?#3.1 C?#4.1 C?#5.1 C?#6.1 C?#7.1 C?#8.1 C?#9.1 C?#10.1 R?#1.2 R?#3.1 R?#4.2 U?#1.3(GND) U?#1.41(EP) USB?.1(GND) USB?.12(GND) USB?.13(SHELL) USB?.14(SHELL)
VBUS_5V: C?#2.2 U?#1.37(VBUS) USB?.2(VBUS) USB?.11(VBUS)
VCC_3V3: C?#8.2 C?#9.2 C?#10.2 U?#1.21(FB1) U?#2.2
VSYS_5V: C?#5.2 C?#7.2 R?#2.1 U?#1.17(ALDOIN) U?#1.23(VIN1) U?#1.34(VSYS) U?#1.36(VMID)
ALDO1: C?#6.2 U?#1.18(ALDO1)
EN: R?#5.2
I2C_SCL: U?#1.39(SCK) ; port I2C.I2C_SCL
I2C_SDA: U?#1.40(SDA) ; port I2C.I2C_SDA
PMIC_IRQ: U?#1.38(IRQ)
PMIC_PG: R?#5.1 U?#1.29(PWROK)
PMIC_PWR_ON: U?#1.30(PWRON)
PMIC_TS: R?#4.1 U?#1.31(TS)
USB_OTG_N: USB?.5(DN2) USB?.7(DN1) ; port OTG.USB_OTG_N
USB_OTG_P: USB?.6(DP1) USB?.8(DP2) ; port OTG.USB_OTG_P
VBAT: C?#3.2 U?#1.33(BAT)
VRTC: C?#4.2 U?#1.28(VRTC)
NetC?#1_2: C?#1.2 U?#1.2(VREF)
NetLED?_1: LED?.1(K) U?#1.1(CHGLED)
NetLED?_2: LED?.2(A) R?#2.2
NetR?#1_1: R?#1.1 USB?.4(CC1)
NetR?#3_2: R?#3.2 USB?.10(CC2)
NetU?#1_22: U?#1.22(LX1) U?#2.1

Not connected (* = marked no-connect by the designer): U?#1 4(FB3)* 5(LX3)* 6(VIN3)* 7(VIN4)* 8(LX4)* 9(FB4)* 10(CPULDOS)* 11(DLDO2/DC4SW)* 12(BLDO1)* 13(BLDOIN)* 14(BLDO2)* 15(ALDO4)* 16(ALDO3)* 19(ALDO2)* 20(DLDO1/DC1SW)* 24(VIN2)* 25(LX2)* 26(FB2)* 27(VBACKUP)* 32(GPIO1/FB5/RTC/LDO2)* 35(SW)*; USB? 3(SBU2)* 9(SBU1)*

### Layout directives
differential pair: USB_OTG_N, USB_OTG_P

### Notes on the sheet
- AXP2101 I2C Addr: 0x68

### Library data of the parts
C?#1 C?#3-C?#5 C?#7 = 1uF: as C5 on sheet ESP32S3
C?#2 = 10uF: as C4 on sheet ESP32S3
C?#6 = 2.2uF: 50V 2.2uF NP0 0402 Ceramic Capacitors ROHS
C?#8 C?#9 = 22uF: 16V 22uF X5R ±20% 0603 Ceramic Capacitors ROHS
C?#10 = 100nF: as C3 on sheet ESP32S3
LED? = KT-0603B: 30mA 2.6V~3.2V Blue 0603 LED Indication - Discrete ROHS
R?#1 R?#3 = 5.1kΩ: 5.1kΩ 62.5mW 50V ±100ppm/℃ Thick Film Resistor ±1% 0402 Chip Resistor - Surface Mount ROHS
R?#2 R?#4 = 10kΩ: as R2 on sheet ESP32S3
R?#5 = 0Ω: as R1 on sheet ESP32S3
U?#2 = WPN252012H1R0MT
USB? = TYPE-C 16PIN 2MD(073): 16pin type-c

## Nets that join several sheets
GND: ESP32S3 (17 pins), LCD (9 pins), Audio_MIC (R10.2), Sensor (24 pins), PMIC (19 pins)
VCC_3V3: ESP32S3 (13 pins), LCD (6 pins), Audio_MIC (8 pins), PMIC (5 pins)
I2C_SCL: LCD (U6.7), Audio_MIC (U7.1)
I2C_SDA: LCD (U6.8), Audio_MIC (U7.19)